# Altium project TI_PRJ_REV2.0.PrjPcb
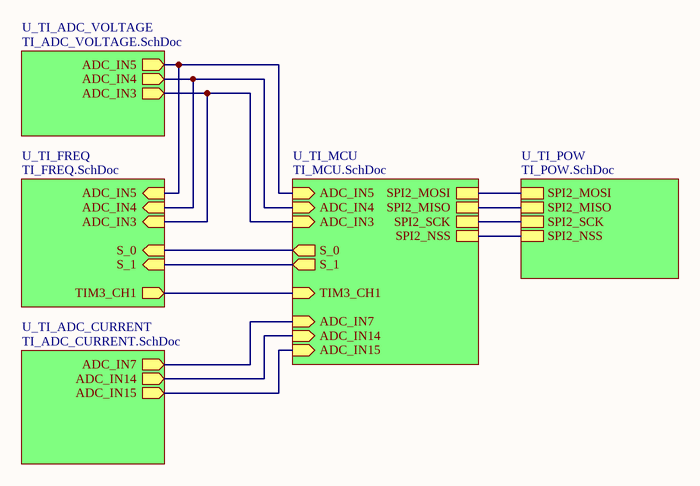
[diagram p0: TI_MAIN.SchDoc]
6 sheets, 90 parts. Net scope: hierarchical (ports join the sheet entries above them; power ports are global).
Board file: TI_PCB.PcbDoc
Sheets:
  TI_MAIN.SchDoc
    U_TI_MCU = TI_MCU.SchDoc
    U_TI_POW = TI_POW.SchDoc
    U_TI_ADC_VOLTAGE = TI_ADC_VOLTAGE.SchDoc
    U_TI_ADC_CURRENT = TI_ADC_CURRENT.SchDoc
    U_TI_FREQ = TI_FREQ.SchDoc

## Sheet TI_MAIN.SchDoc
size A0

### Sub-sheets
U_TI_ADC_CURRENT = TI_ADC_CURRENT.SchDoc: ADC_IN15 (out), ADC_IN7 (out), ADC_IN14 (out)
U_TI_ADC_VOLTAGE = TI_ADC_VOLTAGE.SchDoc: ADC_IN5 (out), ADC_IN3 (out), ADC_IN4 (out)
U_TI_FREQ = TI_FREQ.SchDoc: ADC_IN5 (in), ADC_IN3 (in), ADC_IN4 (in), S_0 (in), S_1 (in), TIM3_CH1 (out)
U_TI_MCU = TI_MCU.SchDoc: SPI2_MOSI, SPI2_MISO, SPI2_SCK, SPI2_NSS, ADC_IN14 (in), TIM3_CH1 (in), ADC_IN15 (in), ADC_IN5 (in), ADC_IN7 (in), ADC_IN3 (in), ADC_IN4 (in), S_0 (out), S_1 (out)
U_TI_POW = TI_POW.SchDoc: SPI2_MOSI, SPI2_MISO, SPI2_SCK, SPI2_NSS

### Nets
SPI2_MISO: sheet U_TI_MCU/SPI2_MISO, sheet U_TI_POW/SPI2_MISO
SPI2_MOSI: sheet U_TI_MCU/SPI2_MOSI, sheet U_TI_POW/SPI2_MOSI
SPI2_NSS: sheet U_TI_MCU/SPI2_NSS, sheet U_TI_POW/SPI2_NSS
SPI2_SCK: sheet U_TI_MCU/SPI2_SCK, sheet U_TI_POW/SPI2_SCK
NetC11_2: sheet U_TI_MCU/TIM3_CH1, sheet U_TI_FREQ/TIM3_CH1
NetR1_1: sheet U_TI_MCU/ADC_IN3, sheet U_TI_ADC_VOLTAGE/ADC_IN3, sheet U_TI_FREQ/ADC_IN3
NetR4_1: sheet U_TI_MCU/ADC_IN4, sheet U_TI_ADC_VOLTAGE/ADC_IN4, sheet U_TI_FREQ/ADC_IN4
NetR5_1: sheet U_TI_MCU/ADC_IN5, sheet U_TI_ADC_VOLTAGE/ADC_IN5, sheet U_TI_FREQ/ADC_IN5
NetR35_1: sheet U_TI_MCU/ADC_IN7, sheet U_TI_ADC_CURRENT/ADC_IN7
NetR36_1: sheet U_TI_MCU/ADC_IN14, sheet U_TI_ADC_CURRENT/ADC_IN14
NetR37_1: sheet U_TI_MCU/ADC_IN15, sheet U_TI_ADC_CURRENT/ADC_IN15
NetU2_18: sheet U_TI_MCU/S_0, sheet U_TI_FREQ/S_0
NetU2_19: sheet U_TI_MCU/S_1, sheet U_TI_FREQ/S_1

## Sheet TI_MCU.SchDoc
size 500 x 500 mm
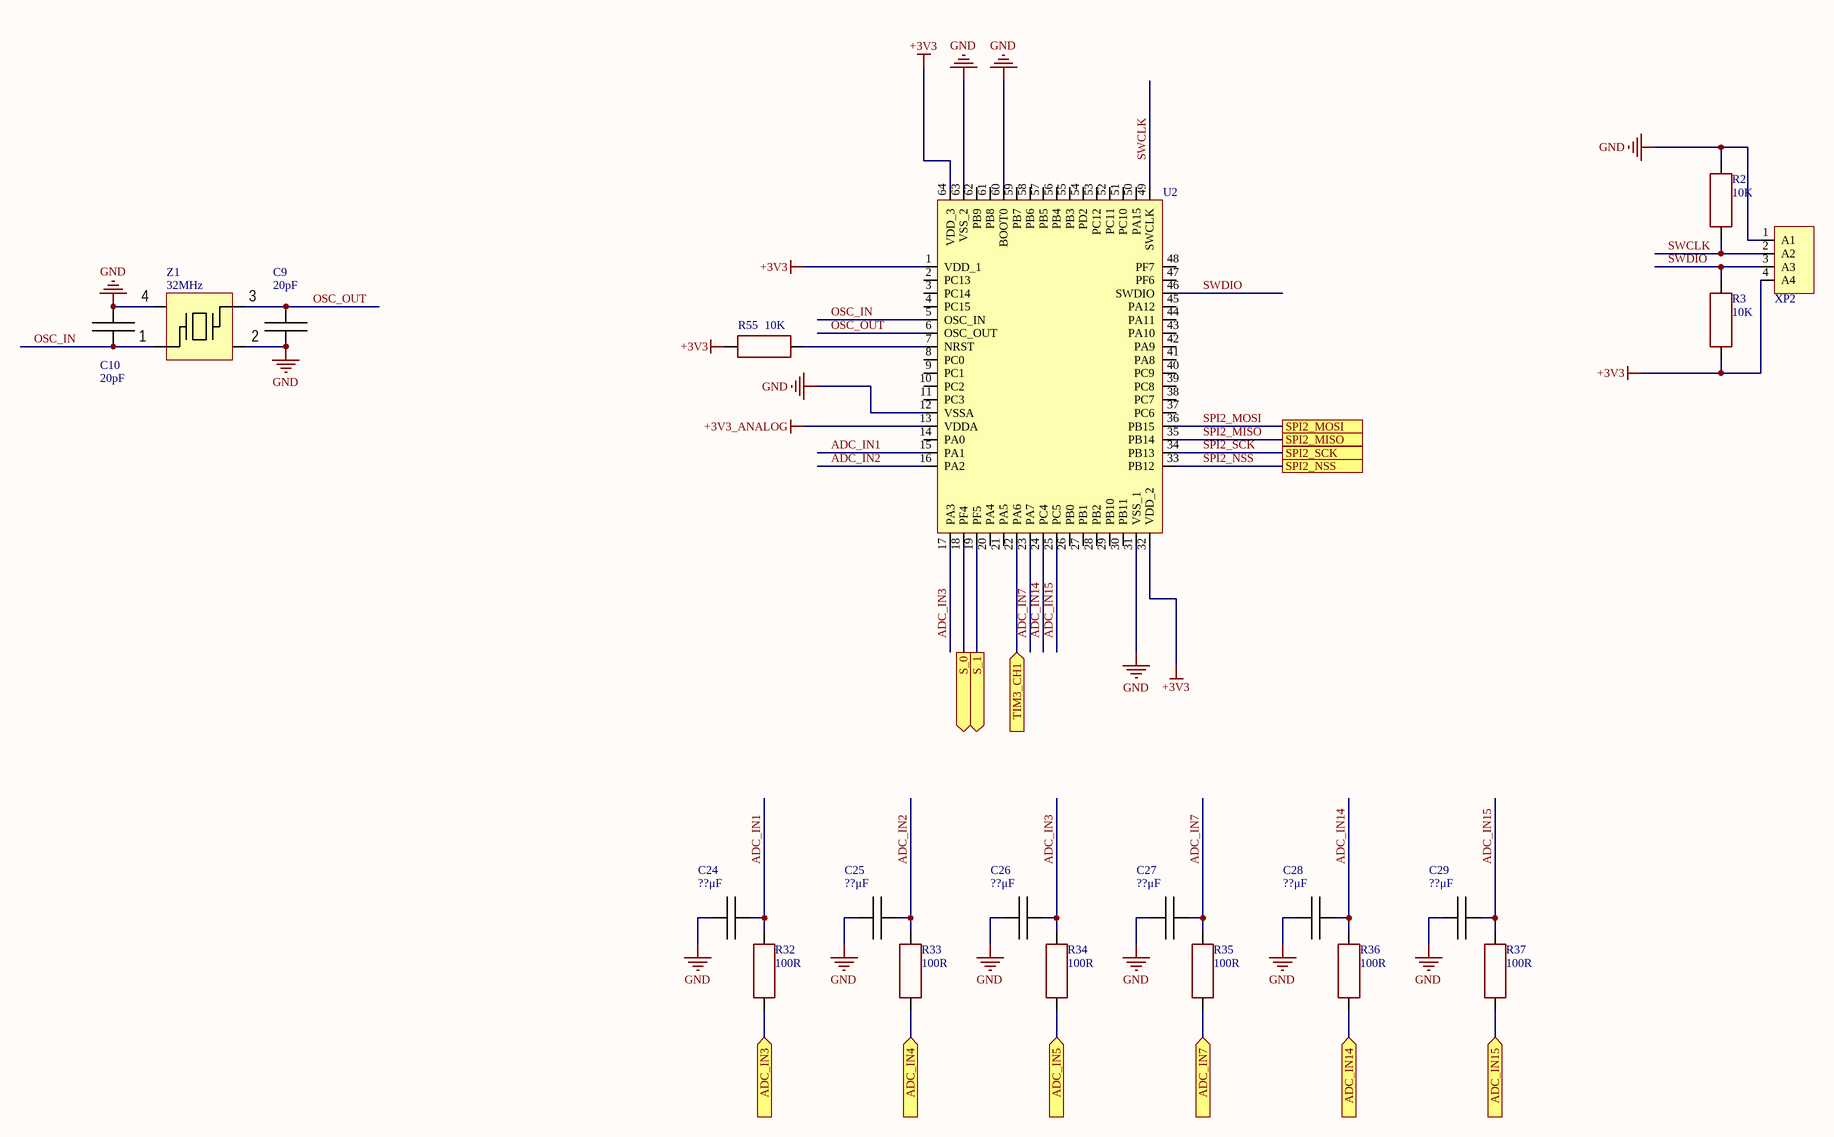
[diagram p1: TI_MCU.SchDoc]

### Parts
C9  value 20pF  [CAP: 0603]  (hidden comment: Cap_0603)
C10  value 20pF  [CAP: 0603]  (hidden comment: Cap_0603)
C24  value ??μF  [CAP: 0603]  (hidden comment: Cap_0603)
C25  value ??μF  [CAP: 0603]  (hidden comment: Cap_0603)
C26  value ??μF  [CAP: 0603]  (hidden comment: Cap_0603)
C27  value ??μF  [CAP: 0603]  (hidden comment: Cap_0603)
C28  value ??μF  [CAP: 0603]  (hidden comment: Cap_0603)
C29  value ??μF  [CAP: 0603]  (hidden comment: Cap_0603)
R2  value 10K  [RES: 0603]  (hidden comment: Resistor_0603)
R3  value 10K  [RES: 0603]  (hidden comment: Resistor_0603)
R32  value 100R  [RES: 0603]  (hidden comment: Resistor_0603)
R33  value 100R  [RES: 0603]  (hidden comment: Resistor_0603)
R34  value 100R  [RES: 0603]  (hidden comment: Resistor_0603)
R35  value 100R  [RES: 0603]  (hidden comment: Resistor_0603)
R36  value 100R  [RES: 0603]  (hidden comment: Resistor_0603)
R37  value 100R  [RES: 0603]  (hidden comment: Resistor_0603)
R55  value 10K  [RES: 0603]  (hidden comment: Resistor_0603)
U2  STM32F030R8T6TR  [LQFP-64]  (value not drawn)
XP2  PLS-6 (DS1021-1x6)  [PLS-4 (DS1021-1x4)]  (value not drawn)
Z1  value 32MHz  [OSC: 2520]  (hidden comment: ECS-320-10-36B2-CTN-TR)

### Ports
ADC_IN3 (in), ADC_IN4 (in), ADC_IN5 (in), ADC_IN7 (in), ADC_IN14 (in), ADC_IN15 (in), S_0 (out), S_1 (out), SPI2_MISO, SPI2_MOSI, SPI2_NSS, SPI2_SCK, TIM3_CH1 (in)

### Nets
+3V3: R3.2 R55.1 U2.1(VDD_1) U2.32(VDD_2) U2.64(VDD_3) XP2.4(A4)
+3V3_ANALOG: U2.13(VDDA)
GND: C9.1 C10.2 C24.1 C25.1 C26.1 C27.1 C28.1 C29.1 R2.1 U2.12(VSSA) U2.31(VSS_1) U2.60(BOOT0) U2.63(VSS_2) XP2.1(A1) Z1.2 Z1.4
ADC_IN1: C24.2 R32.2 U2.15(PA1)
ADC_IN2: C25.2 R33.2 U2.16(PA2)
ADC_IN3: C26.2 R34.2 U2.17(PA3)
ADC_IN7: C27.2 R35.2 U2.23(PA7)
ADC_IN14: C28.2 R36.2 U2.24(PC4)
ADC_IN15: C29.2 R37.2 U2.25(PC5)
OSC_IN: C10.1 U2.5(OSC_IN) Z1.1
OSC_OUT: C9.2 U2.6(OSC_OUT) Z1.3
SPI2_MISO: U2.35(PB14) ; port SPI2_MISO
SPI2_MOSI: U2.36(PB15) ; port SPI2_MOSI
SPI2_NSS: U2.33(PB12) ; port SPI2_NSS
SPI2_SCK: U2.34(PB13) ; port SPI2_SCK
SWCLK: R2.2 U2.49(SWCLK) XP2.2(A2)
SWDIO: R3.1 U2.46(SWDIO) XP2.3(A3)
NetC11_2: U2.22(PA6) ; port TIM3_CH1
NetR1_1: R32.1 ; port ADC_IN3
NetR4_1: R33.1 ; port ADC_IN4
NetR5_1: R34.1 ; port ADC_IN5
NetR35_1: R35.1 ; port ADC_IN7
NetR36_1: R36.1 ; port ADC_IN14
NetR37_1: R37.1 ; port ADC_IN15
NetR55_2: R55.2 U2.7(NRST)
NetU2_18: U2.18(PF4) ; port S_0
NetU2_19: U2.19(PF5) ; port S_1

Not connected (* = marked no-connect by the designer): U2 2(PC13) 3(PC14) 4(PC15) 8(PC0) 9(PC1) 10(PC2) 11(PC3) 14(PA0) 20(PA4) 21(PA5) 26(PB0) 27(PB1) 28(PB2) 29(PB10) 30(PB11) 37(PC6) 38(PC7) 39(PC8) 40(PC9) 41(PA8) 42(PA9) 43(PA10) 44(PA11) 45(PA12) 47(PF6) 48(PF7) 50(PA15) 51(PC10) 52(PC11) 53(PC12) 54(PD2) 55(PB3) 56(PB4) 57(PB5) 58(PB6) 59(PB7) 61(PB8) 62(PB9)

### Library data of the parts
C9 C10 = Cap_0603: TypeDielectric: X7R(X5R); Voltage: 50V; Package/Case: 0603; Temperature: -55...+125°C(-55...+85°C); Product Category: Capacitors
C24-C29 = Cap_0603: TypeDielectric: X7R(X5R); Voltage: ??V; Package/Case: 0603; Temperature: -55...+125°C(-55...+85°C); Product Category: Capacitors
R2 R3 R55 = Resistor_0603: Power: 0.1W; Tolerance: ±1%; Package/Case: 0603; Temperature: -55...+125°C; Product Category: Resistors
R32-R37 = Resistor_0603: Power: 0.1W; Tolerance: ±5%; Package/Case: 0603; Temperature: -55...+125°C; Product Category: Resistors
U2 = STM32F030R8T6TR: MCU Mainstream Arm Cortex-M0 Value line MCU 64 Kbytes of Flash , 48 MHz CPU; Manufacturer: STMicroelectronics; Datasheet: https://www.st.com/resource/en/datasheet/stm32f030r8.pdf; HelpURL: https://eu.mouser.com/ProductDetail/STMicroelectronics/STM32F030R8T6TR?qs=s5SkPsIz10%252B%252B1w15QiyTpQ%3D%3D; Package/Case: LQFP-64; Product Category: Microcontrollers
XP2 = PLS-4 (DS1021-1x4): Board to Board, Surface Mount, Single row, 6 Positions, 2.54mm, Vertical.; Manufacturer: Connfly; Datasheet: https://static.chipdip.ru/lib/977/DOC005977245.pdf; HelpURL: https://www.chipdip.by/product/pls-4; Product Category: Connectors
Z1 = ECS-320-10-36B2-CTN-TR: Crystal 32.000 MHz 10 pF +/-10 +/-20 -40 +85 C +/-2 ppm Max.; Manufacturer: ECS; Package/Case: 2520; HelpURL: https://eu.mouser.com/ProductDetail/ECS/ECS-320-10-36B2-CTN-TR?qs=QNEnbhJQKvbusIFiAH6chw%3D%3D; Temperature: -40...+85°C; Datasheet: https://eu.mouser.com/datasheet/2/122/ECX_2236B2-2400583.pdf; Product Category: Crystals

## Sheet TI_POW.SchDoc
size A0
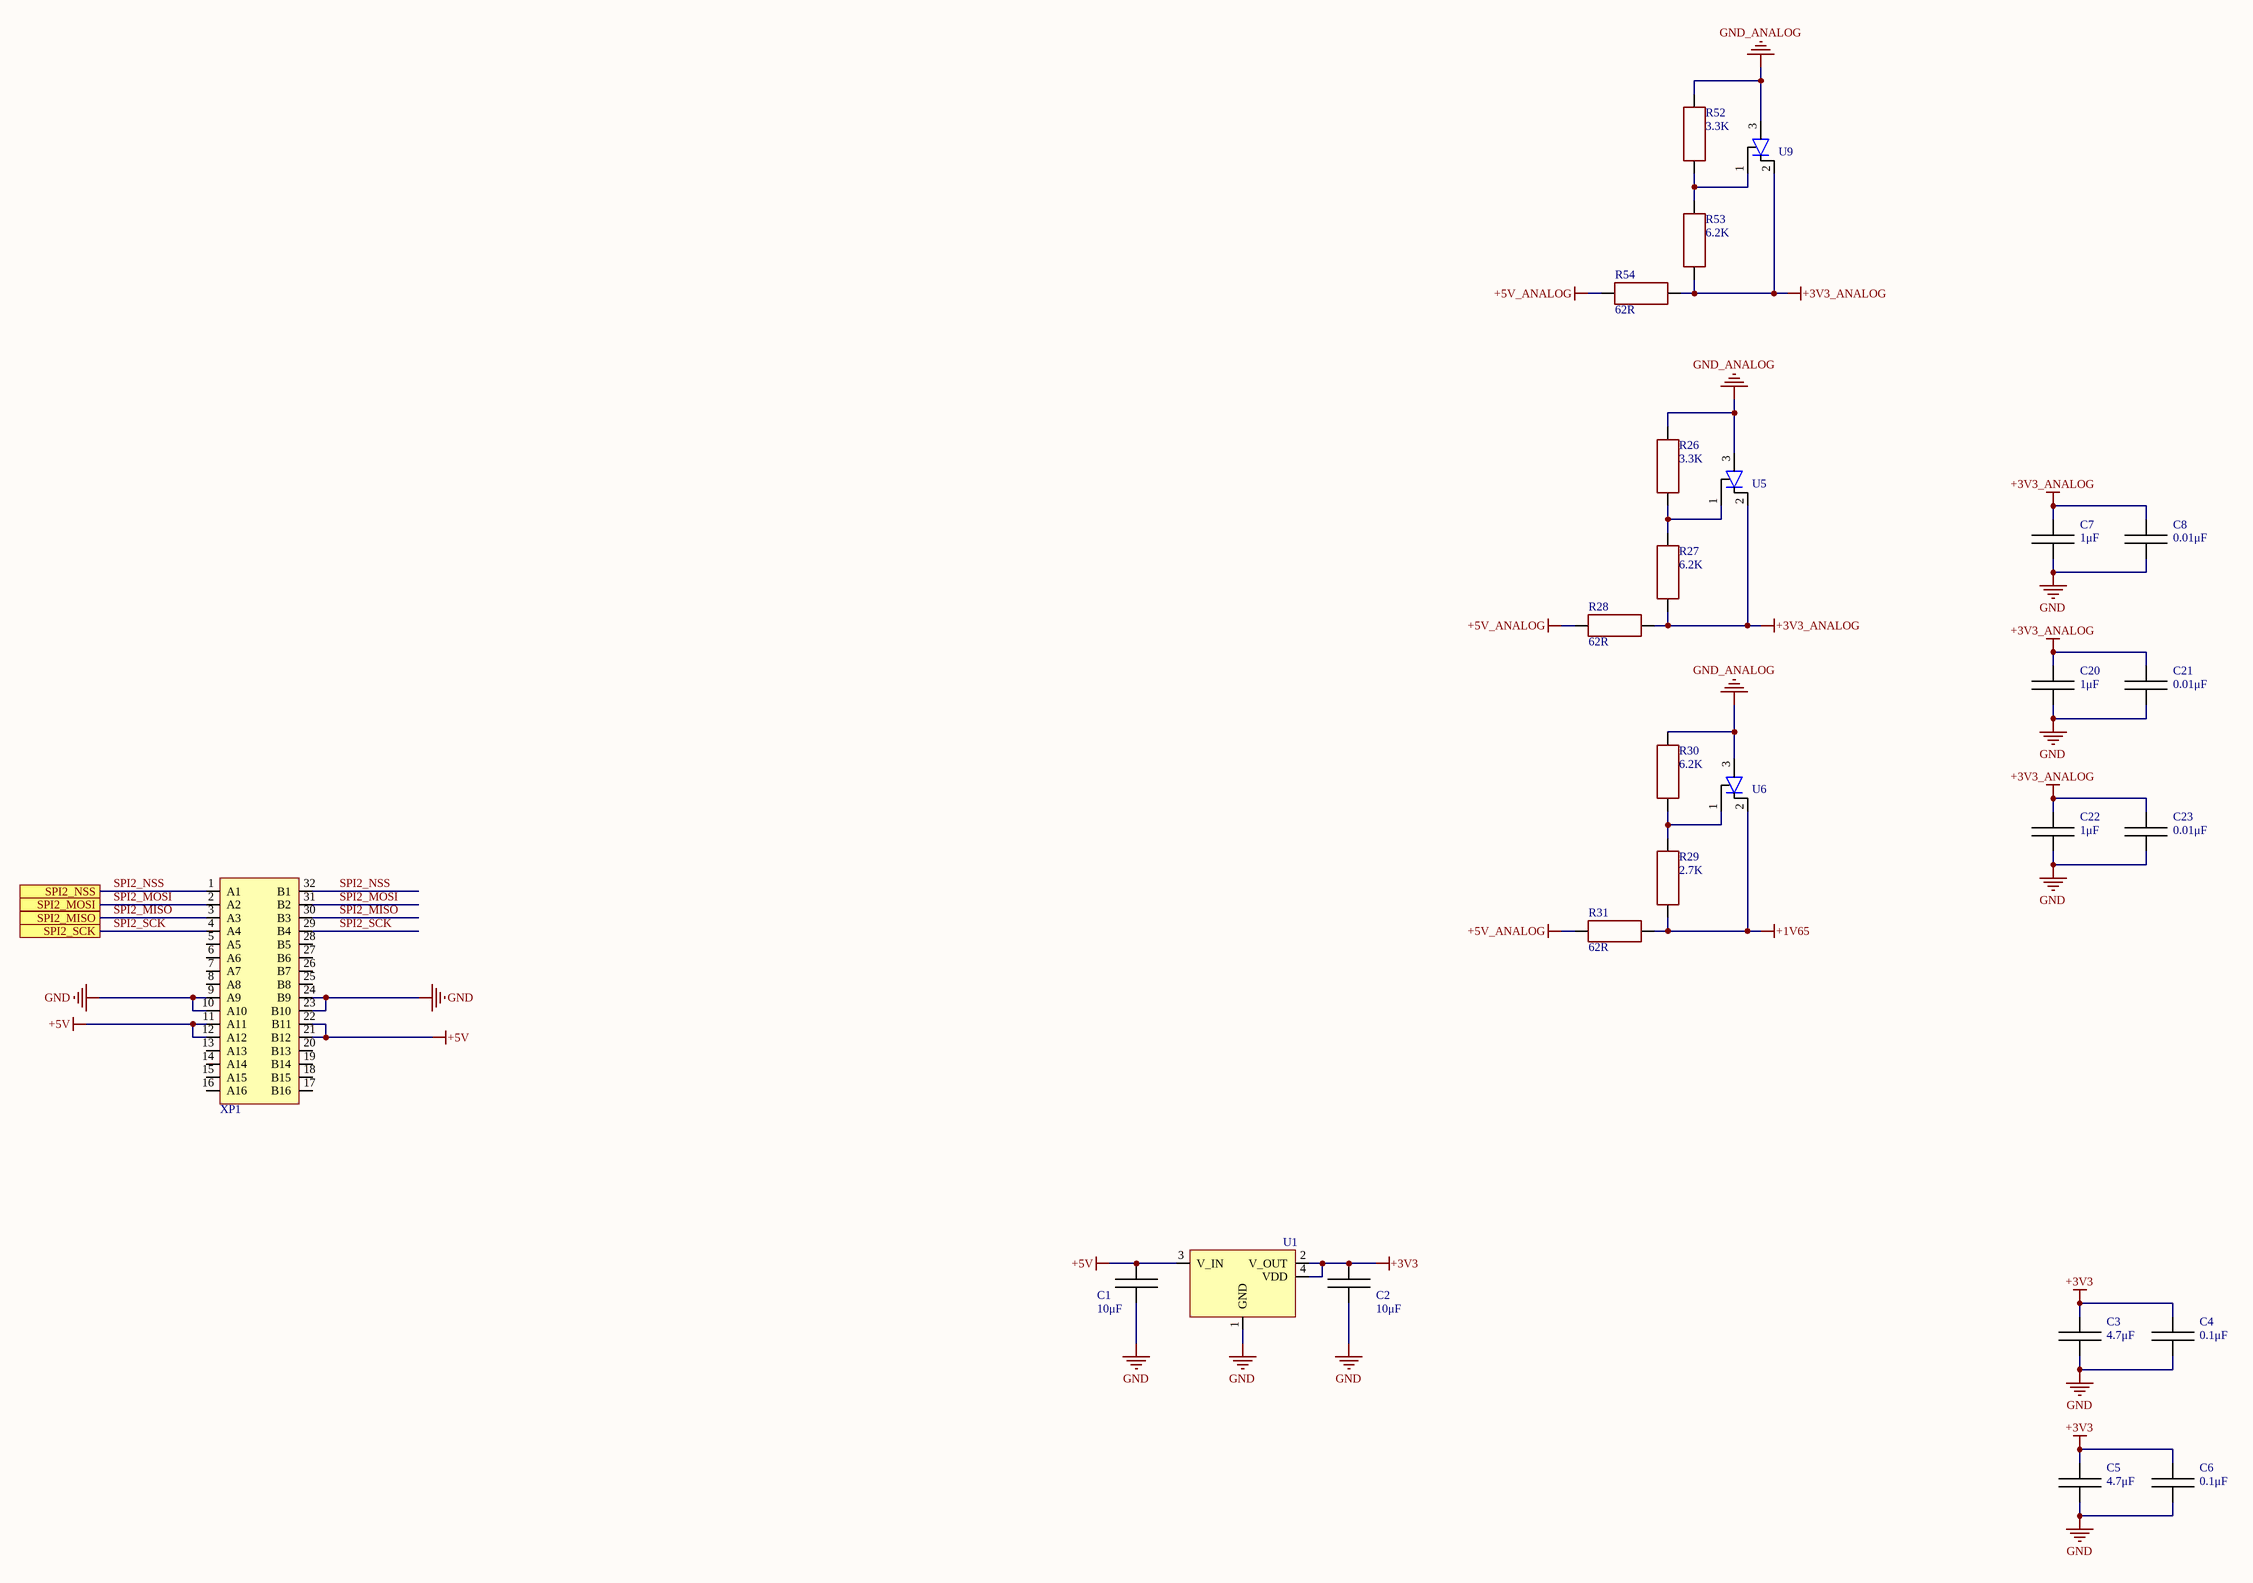
[diagram p2: TI_POW.SchDoc]

### Parts
C1  value 10μF  [CAP: 2220]  (hidden comment: Cap_2220)
C2  value 10μF  [CAP: 2220]  (hidden comment: Cap_2220)
C3  value 4.7μF  [CAP: 0603]  (hidden comment: Cap_0603)
C4  value 0.1μF  [CAP: 0603]  (hidden comment: Cap_0603)
C5  value 4.7μF  [CAP: 0603]  (hidden comment: Cap_0603)
C6  value 0.1μF  [CAP: 0603]  (hidden comment: Cap_0603)
C7  value 1μF  [CAP: 0603]  (hidden comment: Cap_0603)
C8  value 0.01μF  [CAP: 0603]  (hidden comment: Cap_0603)
C20  value 1μF  [CAP: 0603]  (hidden comment: Cap_0603)
C21  value 0.01μF  [CAP: 0603]  (hidden comment: Cap_0603)
C22  value 1μF  [CAP: 0603]  (hidden comment: Cap_0603)
C23  value 0.01μF  [CAP: 0603]  (hidden comment: Cap_0603)
R26  value 3.3K  [RES: 0603]  (hidden comment: Resistor_0603)
R27  value 6.2K  [RES: 0603]  (hidden comment: Resistor_0603)
R28  value 62R  [RES: 0603]  (hidden comment: Resistor_0603)
R29  value 2.7K  [RES: 0603]  (hidden comment: Resistor_0603)
R30  value 6.2K  [RES: 0603]  (hidden comment: Resistor_0603)
R31  value 62R  [RES: 0603]  (hidden comment: Resistor_0603)
R52  value 3.3K  [RES: 0603]  (hidden comment: Resistor_0603)
R53  value 6.2K  [RES: 0603]  (hidden comment: Resistor_0603)
R54  value 62R  [RES: 0603]  (hidden comment: Resistor_0603)
U1  LD1117S33CTR4  [SOT-223-3]  (value not drawn)
U5  TLVH431BIL3T  [SOT-23-3]  (value not drawn)
U6  TLVH431BIL3T  [SOT-23-3]  (value not drawn)
U9  TLVH431BIL3T  [SOT-23-3]  (value not drawn)
XP1  DS1118-32M-R23  [DS1118-32M-R23]  (value not drawn)

### Ports
SPI2_MISO, SPI2_MOSI, SPI2_NSS, SPI2_SCK

### Nets
+1V65: R29.1 R31.1 U6.2
+3V3: C2.2 C3.2 C4.2 C5.2 C6.2 U1.2(V_OUT) U1.4(VDD)
+3V3_ANALOG: C7.2 C8.2 C20.2 C21.2 C22.2 C23.2 R27.1 R28.1 R53.1 R54.1 U5.2 U9.2
+5V: C1.2 U1.3(V_IN) XP1.11(A11) XP1.12(A12) XP1.21(B12) XP1.22(B11)
+5V_ANALOG: R28.2 R31.2 R54.2
GND: C1.1 C2.1 C3.1 C4.1 C5.1 C6.1 C7.1 C8.1 C20.1 C21.1 C22.1 C23.1 U1.1(GND) XP1.9(A9) XP1.10(A10) XP1.23(B10) XP1.24(B9)
GND_ANALOG: R26.2 R30.2 R52.2 U5.3 U6.3 U9.3
SPI2_MISO: XP1.3(A3) XP1.30(B3) ; port SPI2_MISO
SPI2_MOSI: XP1.2(A2) XP1.31(B2) ; port SPI2_MOSI
SPI2_NSS: XP1.1(A1) XP1.32(B1) ; port SPI2_NSS
SPI2_SCK: XP1.4(A4) XP1.29(B4) ; port SPI2_SCK
NetR26_1: R26.1 R27.2 U5.1
NetR29_2: R29.2 R30.1 U6.1
NetR52_1: R52.1 R53.2 U9.1

Not connected (* = marked no-connect by the designer): XP1 5(A5) 6(A6) 7(A7) 8(A8) 13(A13) 14(A14) 15(A15) 16(A16) 17(B16) 18(B15) 19(B14) 20(B13) 25(B8) 26(B7) 27(B6) 28(B5)

### Library data of the parts
C1 C2 = Cap_2220: TypeDielectric: X7R(X5R); Voltage: 16V; Package/Case: 2220; Temperature: -55...+125°C(-55...+85°C); Product Category: Capacitors
C3 C5 = Cap_0603: TypeDielectric: X7R(X5R); Voltage: 25V; Package/Case: 0603; Temperature: -55...+125°C(-55...+85°C); Product Category: Capacitors
C4 C6 C7 C20 C22 = Cap_0603: TypeDielectric: X7R(X5R); Voltage: 16V; Package/Case: 0603; Temperature: -55...+125°C(-55...+85°C); Product Category: Capacitors
C8 C21 C23 = Cap_0603: TypeDielectric: X7R(X5R); Voltage: 50V; Package/Case: 0603; Temperature: -55...+125°C(-55...+85°C); Product Category: Capacitors
R26-R31 R52-R54 = Resistor_0603: Power: 0.1W; Tolerance: ±5%; Package/Case: 0603; Temperature: -55...+125°C; Product Category: Resistors
U1 = LD1117S33CTR: LDO Voltage Regulator 3.3V 0.8A Positive; Manufacturer: STMicroelectronics; Datasheet: https://eu.mouser.com/datasheet/2/389/cd00000544-1795431.pdf; HelpURL: https://eu.mouser.com/ProductDetail/STMicroelectronics/LD1117S33CTR?qs=8u%2FLf1IQwKF9meFZLHfRog%3D%3D; Package/Case: SOT-223-3; Product Category: Voltage Regulators
U5 U6 U9 = TLVH431BIL3T: Voltage References 1.24V to 18V Prog Shunt Ref 100uA 60mA; Manufacturer: STMicroelectronics; Datasheet: https://eu.mouser.com/datasheet/2/389/dm00057412-1797844.pdf; HelpURL: https://eu.mouser.com/ProductDetail/STMicroelectronics/TLVH431BIL3T?qs=NC%2FuX8ipg1S4rbg4USQCPA%3D%3D; Package/Case: SOT-23; Product Category: Voltage References
XP1 = DS1118-32M-R23: DIN 41612 Connector; Manufacturer: Connfly; Analogue: HARTING 09221326951(https://eu.mouser.com/ProductDetail/HARTING/09221326951?qs=Afqhj6cPmO9f0oVZo6yWiA%3D%3D); Datasheet: http://en.connfly.group/static/upload/file/pdf/DS1118.pdf; HelpURL: https://www.chipdip.by/product/din41612r-ds1118-32m-r23; Product Category: Connectors

## Sheet TI_ADC_VOLTAGE.SchDoc
size 500 x 500 mm
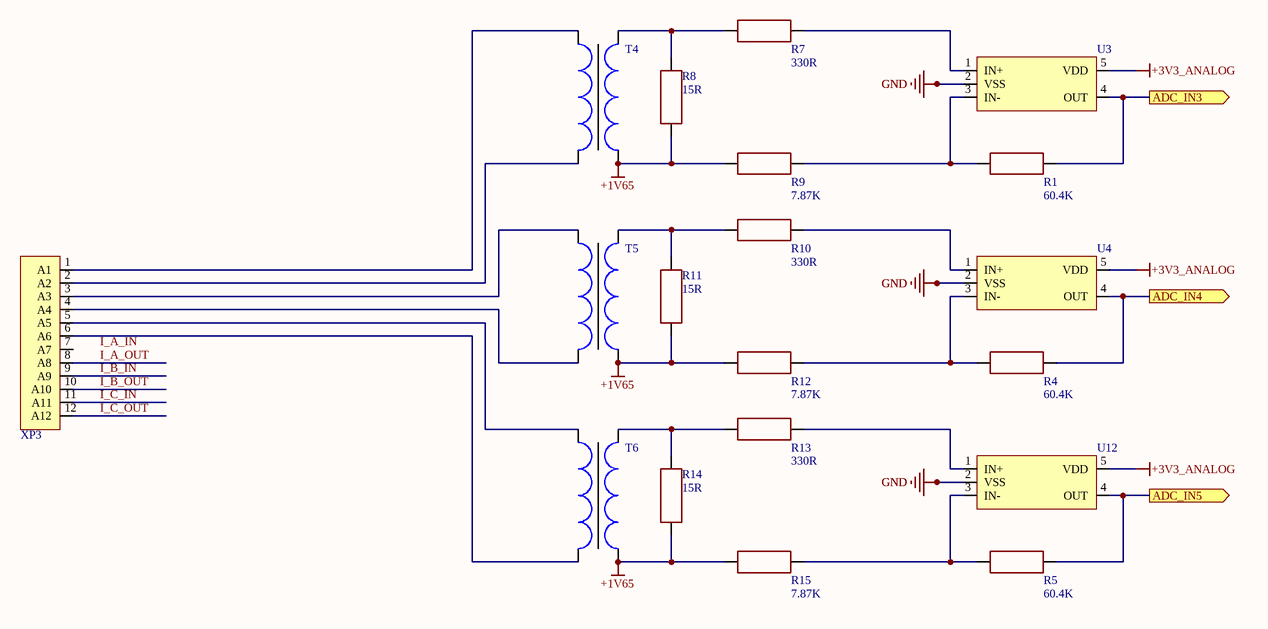
[diagram p3: TI_ADC_VOLTAGE.SchDoc]

### Parts
R1  value 60.4K  [RES: 0603]  (hidden comment: Resistor_0603)
R4  value 60.4K  [RES: 0603]  (hidden comment: Resistor_0603)
R5  value 60.4K  [RES: 0603]  (hidden comment: Resistor_0603)
R7  value 330R  [RES: 0603]  (hidden comment: Resistor_0603)
R8  value 15R  [RES: 0603]  (hidden comment: Resistor_0603)
R9  value 7.87K  [RES: 0603]  (hidden comment: Resistor_0603)
R10  value 330R  [RES: 0603]  (hidden comment: Resistor_0603)
R11  value 15R  [RES: 0603]  (hidden comment: Resistor_0603)
R12  value 7.87K  [RES: 0603]  (hidden comment: Resistor_0603)
R13  value 330R  [RES: 0603]  (hidden comment: Resistor_0603)
R14  value 15R  [RES: 0603]  (hidden comment: Resistor_0603)
R15  value 7.87K  [RES: 0603]  (hidden comment: Resistor_0603)
T4  TV31B02  [TV31B02]  (value not drawn)
T5  TV31B02  [TV31B02]  (value not drawn)
T6  TV31B02  [TV31B02]  (value not drawn)
U3  MCP6001U  [SOT-23-5]  (value not drawn)
U4  MCP6001U  [SOT-23-5]  (value not drawn)
U12  MCP6001U  [SOT-23-5]  (value not drawn)
XP3  PLS-6 (DS1MSTB 2,5/12-GF-5,08021-1x6)  [MSTB 2,5/12-GF-5,08]  (value not drawn)

### Ports
ADC_IN3 (out), ADC_IN4 (out), ADC_IN5 (out)

### Nets
+1V65: R8.2 R9.1 R11.2 R12.1 R14.2 R15.1 T4.2 T5.2 T6.2
+3V3_ANALOG: U3.5(VDD) U4.5(VDD) U12.5(VDD)
GND: U3.2(VSS) U4.2(VSS) U12.2(VSS)
I_A_OUT: XP3.8(A8)
I_B_IN: XP3.9(A9)
I_B_OUT: XP3.10(A10)
I_C_IN: XP3.11(A11)
I_C_OUT: XP3.12(A12)
NetR1_1: R1.1 U3.4(OUT) ; port ADC_IN3
NetR1_2: R1.2 R9.2 U3.3(IN-)
NetR4_1: R4.1 U4.4(OUT) ; port ADC_IN4
NetR4_2: R4.2 R12.2 U4.3(IN-)
NetR5_1: R5.1 U12.4(OUT) ; port ADC_IN5
NetR5_2: R5.2 R15.2 U12.3(IN-)
NetR7_1: R7.1 R8.1 T4.1
NetR7_2: R7.2 U3.1(IN+)
NetR10_1: R10.1 R11.1 T5.1
NetR10_2: R10.2 U4.1(IN+)
NetR13_1: R13.1 R14.1 T6.1
NetR13_2: R13.2 U12.1(IN+)
NetT4_3: T4.3 XP3.2(A2)
NetT4_4: T4.4 XP3.1(A1)
NetT5_3: T5.3 XP3.4(A4)
NetT5_4: T5.4 XP3.3(A3)
NetT6_3: T6.3 XP3.6(A6)
NetT6_4: T6.4 XP3.5(A5)

Not connected (* = marked no-connect by the designer): XP3 7(A7)

### Notes on the sheet
- Labels drawn without touching a wire or pin: I_A_IN

### Library data of the parts
R1 R4 R5 R7-R15 = Resistor_0603: Power: 0.1W; Tolerance: ±5%; Package/Case: 0603; Temperature: -55...+125°C; Product Category: Resistors
T4-T6 = TV31B02: Current-type Voltage Transformer; Manufacturer: YUANXING; Analogue: ZMPT101B(https://5nrorwxhmqqijik.leadongcdn.com/ZMPT101B+specification-aidijBqoKomRilSqqokpjkp.pdf); Datasheet: https://www.yuanxing.net/pdf/current%20type%20voltage%20transformers.pdf; Product Category: Current-type Voltage Transformer
U3 U4 U12 = MCP6001U: 1 MHz, Low-Power Op Amp; Manufacturer: Microchip; Datasheet: https://eu.mouser.com/ProductDetail/Microchip-Technology-Atmel/MCP6004-I-SL?qs=n%2FfJlMG9rCZ2%2F%2FCryvZ52w%3D%3D; HelpURL: https://eu.mouser.com/ProductDetail/Microchip-Technology-Atmel/MCP6001UT-I-OT?qs=Sez7gRs8XSU2iw24kVuIOw%3D%3D; Package/Case: SOT-23-5; Product Category: Operational Amplifiers
XP3 = MSTB 2,5/12-GF-5,08: Surface Mount, Single row, 12 Positions, 5.08mm; Manufacturer: Phoenix contact; Datasheet: https://www.phoenixcontact.com/ru-pc/produkty/korpusnaa-cast-dla-pecatnyh-plat-mstb-25-12-gf-508-1776605; HelpURL: https://www.phoenixcontact.com/ru-pc/produkty/korpusnaa-cast-dla-pecatnyh-plat-mstb-25-12-gf-508-1776605; Product Category: Connectors

## Sheet TI_ADC_CURRENT.SchDoc
size 999 x 999 mm
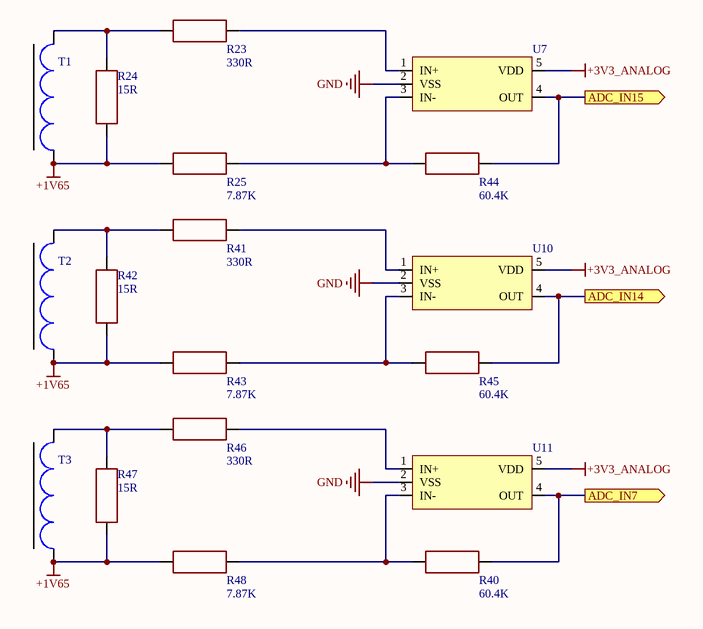
[diagram p4: TI_ADC_CURRENT.SchDoc]

### Parts
R23  value 330R  [RES: 0603]  (hidden comment: Resistor_0603)
R24  value 15R  [RES: 0603]  (hidden comment: Resistor_0603)
R25  value 7.87K  [RES: 0603]  (hidden comment: Resistor_0603)
R40  value 60.4K  [RES: 0603]  (hidden comment: Resistor_0603)
R41  value 330R  [RES: 0603]  (hidden comment: Resistor_0603)
R42  value 15R  [RES: 0603]  (hidden comment: Resistor_0603)
R43  value 7.87K  [RES: 0603]  (hidden comment: Resistor_0603)
R44  value 60.4K  [RES: 0603]  (hidden comment: Resistor_0603)
R45  value 60.4K  [RES: 0603]  (hidden comment: Resistor_0603)
R46  value 330R  [RES: 0603]  (hidden comment: Resistor_0603)
R47  value 15R  [RES: 0603]  (hidden comment: Resistor_0603)
R48  value 7.87K  [RES: 0603]  (hidden comment: Resistor_0603)
T1  AC-1005  [AC-1005]  (value not drawn)
T2  AC-1005  [AC-1005]  (value not drawn)
T3  AC-1005  [AC-1005]  (value not drawn)
U7  MCP6001U  [SOT-23-5]  (value not drawn)
U10  MCP6001U  [SOT-23-5]  (value not drawn)
U11  MCP6001U  [SOT-23-5]  (value not drawn)

### Ports
ADC_IN7 (out), ADC_IN14 (out), ADC_IN15 (out)

### Nets
+1V65: R24.1 R25.1 R42.2 R43.1 R47.1 R48.1 T1.1 T2.1 T3.1
+3V3_ANALOG: U7.5(VDD) U10.5(VDD) U11.5(VDD)
GND: U7.2(VSS) U10.2(VSS) U11.2(VSS)
NetR23_1: R23.1 R24.2 T1.2
NetR23_2: R23.2 U7.1(IN+)
NetR25_2: R25.2 R44.2 U7.3(IN-)
NetR35_1: R40.1 U11.4(OUT) ; port ADC_IN7
NetR36_1: R45.1 U10.4(OUT) ; port ADC_IN14
NetR37_1: R44.1 U7.4(OUT) ; port ADC_IN15
NetR40_2: R40.2 R48.2 U11.3(IN-)
NetR41_1: R41.1 R42.1 T2.2
NetR41_2: R41.2 U10.1(IN+)
NetR43_2: R43.2 R45.2 U10.3(IN-)
NetR46_1: R46.1 R47.2 T3.2
NetR46_2: R46.2 U11.1(IN+)

### Library data of the parts
R23-R25 R40-R48 = Resistor_0603: Power: 0.1W; Tolerance: ±5%; Package/Case: 0603; Temperature: -55...+125°C; Product Category: Resistors
T1-T3 = AC-1005: Current Transformer, primary current: 5A; Manufacturer: Talema; Analogue: CST-1005(https://eu.mouser.com/datasheet/2/410/CST_1005-1892657.pdf); Datasheet: https://static.chipdip.ru/lib/884/DOC003884697.pdf; HelpURL: https://www.chipdip.ru/product/ac-1005; Product Category: Current Transformers
U7 U10 U11 = MCP6001U: as U3 on sheet TI_ADC_VOLTAGE; Datasheet: https://eu.mouser.com/ProductDetail/Microchip-Technology-Atmel/MCP6004-I-SL?qs=n%2FfJlMG9rCZ2%2F%2FCryvZ52w%3D%3D; HelpURL: https://eu.mouser.com/ProductDetail/Microchip-Technology-Atmel/MCP6001UT-I-OT?qs=Sez7gRs8XSU2iw24kVuIOw%3D%3D; Package/Case: SOT-23-5; Product Category: Operational Amplifiers

## Sheet TI_FREQ.SchDoc
size A4
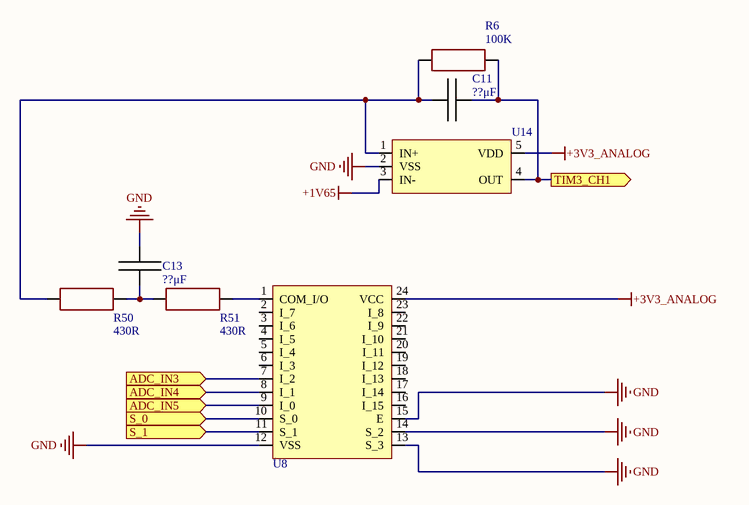
[diagram p5: TI_FREQ.SchDoc]

### Parts
C11  value ??μF  [CAP: 0603]  (hidden comment: Cap_0603)
C13  value ??μF  [CAP: 0603]  (hidden comment: Cap_0603)
R6  value 100K  [RES: 0603]  (hidden comment: Resistor_0603)
R50  value 430R  [RES: 0603]  (hidden comment: Resistor_0603)
R51  value 430R  [RES: 0603]  (hidden comment: Resistor_0603)
U8  CD74HC4067M96  [SOIC-24]  (value not drawn)
U14  MCP6001U  [SOT-23-5]  (value not drawn)

### Ports
ADC_IN3 (in), ADC_IN4 (in), ADC_IN5 (in), S_0 (in), S_1 (in), TIM3_CH1 (out)

### Nets
+1V65: U14.3(IN-)
+3V3_ANALOG: U8.24(VCC) U14.5(VDD)
GND: C13.2 U8.12(VSS) U8.13(S_3) U8.14(S_2) U8.15(E) U14.2(VSS)
NetC11_1: C11.1 R6.2 R50.1 U14.1(IN+)
NetC11_2: C11.2 R6.1 U14.4(OUT) ; port TIM3_CH1
NetC13_1: C13.1 R50.2 R51.1
NetR1_1: U8.7(I_2) ; port ADC_IN3
NetR4_1: U8.8(I_1) ; port ADC_IN4
NetR5_1: U8.9(I_0) ; port ADC_IN5
NetR51_2: R51.2 U8.1(COM_I/O)
NetU2_18: U8.10(S_0) ; port S_0
NetU2_19: U8.11(S_1) ; port S_1

Not connected (* = marked no-connect by the designer): U8 2(I_7) 3(I_6) 4(I_5) 5(I_4) 6(I_3) 16(I_15) 17(I_14) 18(I_13) 19(I_12) 20(I_11) 21(I_10) 22(I_9) 23(I_8)

### Library data of the parts
C11 C13 = Cap_0603: TypeDielectric: X7R(X5R); Voltage: ??V; Package/Case: 0603; Temperature: -55...+125°C(-55...+85°C); Product Category: Capacitors
R6 R50 R51 = Resistor_0603: Power: 0.1W; Tolerance: ±5%; Package/Case: 0603; Temperature: -55...+125°C; Product Category: Resistors
U8 = CD74HC4067M96: 1 MHz, Low-Power Op Amp; Manufacturer: Texas Instruments; Datasheet: https://www.ti.com/general/docs/suppproductinfo.tsp?distId=26&gotoUrl=https://www.ti.com/lit/gpn/cd74hct4067; HelpURL: https://eu.mouser.com/ProductDetail/Texas-Instruments/CD74HC4067M96?qs=xFfolx0DHx0XT7d9xTTZBA%3D%3D; Package/Case: SOIC-24; Product Category: Multiplexers
U14 = MCP6001U: as U3 on sheet TI_ADC_VOLTAGE; Datasheet: https://eu.mouser.com/ProductDetail/Microchip-Technology-Atmel/MCP6004-I-SL?qs=n%2FfJlMG9rCZ2%2F%2FCryvZ52w%3D%3D; HelpURL: https://eu.mouser.com/ProductDetail/Microchip-Technology-Atmel/MCP6001UT-I-OT?qs=Sez7gRs8XSU2iw24kVuIOw%3D%3D; Package/Case: SOT-23-5; Product Category: Operational Amplifiers

## Nets that join several sheets
+1V65: TI_POW (R29.1 R31.1 U6.2), TI_ADC_VOLTAGE (9 pins), TI_ADC_CURRENT (9 pins), TI_FREQ (U14.3)
+3V3: TI_MCU (6 pins), TI_POW (7 pins)
+3V3_ANALOG: TI_MCU (U2.13), TI_POW (12 pins), TI_ADC_VOLTAGE (U3.5 U4.5 U12.5), TI_ADC_CURRENT (U7.5 U10.5 U11.5), TI_FREQ (U8.24 U14.5)
GND: TI_MCU (16 pins), TI_POW (17 pins), TI_ADC_VOLTAGE (U3.2 U4.2 U12.2), TI_ADC_CURRENT (U7.2 U10.2 U11.2), TI_FREQ (6 pins)
NetC11_2: TI_MCU (U2.22), TI_FREQ (C11.2 R6.1 U14.4)
NetR1_1: TI_MCU (R32.1), TI_ADC_VOLTAGE (R1.1 U3.4), TI_FREQ (U8.7)
NetR4_1: TI_MCU (R33.1), TI_ADC_VOLTAGE (R4.1 U4.4), TI_FREQ (U8.8)
NetR5_1: TI_MCU (R34.1), TI_ADC_VOLTAGE (R5.1 U12.4), TI_FREQ (U8.9)
NetR35_1: TI_MCU (R35.1), TI_ADC_CURRENT (R40.1 U11.4)
NetR36_1: TI_MCU (R36.1), TI_ADC_CURRENT (R45.1 U10.4)
NetR37_1: TI_MCU (R37.1), TI_ADC_CURRENT (R44.1 U7.4)
NetU2_18: TI_MCU (U2.18), TI_FREQ (U8.10)
NetU2_19: TI_MCU (U2.19), TI_FREQ (U8.11)
SPI2_MISO: TI_MCU (U2.35), TI_POW (XP1.3 XP1.30)
SPI2_MOSI: TI_MCU (U2.36), TI_POW (XP1.2 XP1.31)
SPI2_NSS: TI_MCU (U2.33), TI_POW (XP1.1 XP1.32)
SPI2_SCK: TI_MCU (U2.34), TI_POW (XP1.4 XP1.29)